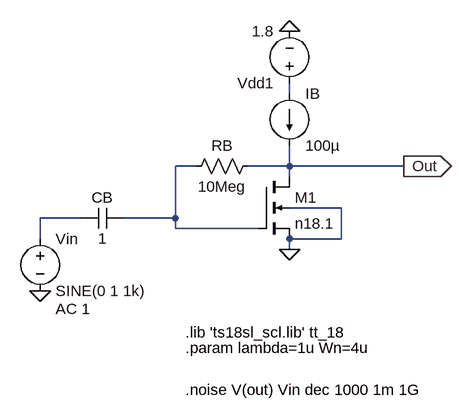
[diagram p0: schematic Q3.asc]
Q3.asc, the LTspice schematic file:
Version 4.1
SHEET 1 880 680
WIRE 192 -16 192 -32
WIRE 48 96 16 96
WIRE 192 96 192 64
WIRE 192 96 128 96
WIRE 368 96 192 96
WIRE 192 112 192 96
WIRE 272 160 192 160
WIRE -128 176 -192 176
WIRE 16 176 16 96
WIRE 16 176 -64 176
WIRE 16 192 16 176
WIRE 144 192 16 192
WIRE -192 208 -192 176
WIRE 272 208 272 160
WIRE 272 208 192 208
WIRE 192 224 192 208
FLAG 192 -112 0
FLAG 192 224 0
FLAG -192 288 0
FLAG 368 96 Out
IOPIN 368 96 Out
SYMBOL voltage 192 -16 R180
WINDOW 123 0 0 Left 0
WINDOW 39 0 0 Left 0
SYMATTR InstName Vdd1
SYMATTR Value 1.8
SYMBOL nmos4 144 112 R0
SYMATTR InstName M1
SYMATTR Value n18.1
SYMATTR Value2 l={2*lambda} w={Wn} ad={5*lambda*Wn} as={5*lambda*Wn} pd={2*Wn + 10*lambda} ps={2*Wn + 10*lambda}
SYMBOL voltage -192 192 R0
WINDOW 123 24 124 Left 2
WINDOW 39 0 0 Left 0
SYMATTR Value2 AC 1
SYMATTR InstName Vin
SYMATTR Value SINE(0 1 1k)
SYMBOL current 192 -16 R0
WINDOW 123 0 0 Left 0
WINDOW 39 0 0 Left 0
SYMATTR InstName IB
SYMATTR Value 100µ
SYMBOL res 144 80 R90
WINDOW 0 0 56 VBottom 2
WINDOW 3 32 56 VTop 2
SYMATTR InstName RB
SYMATTR Value 10Meg
SYMBOL cap -64 160 R90
WINDOW 0 0 32 VBottom 2
WINDOW 3 32 32 VTop 2
SYMATTR InstName CB
SYMATTR Value 1
TEXT 32 376 Left 2 !.param lambda=1u Wn=4u
TEXT 32 352 Left 2 !.lib 'ts18sl_scl.lib' tt_18
TEXT 32 440 Left 2 !.noise V(out) Vin dec 1000 1m 1G

The netlist it stands for:
* Q3.asc
Vdd1 N001 0 1.8
M1 Out N002 0 0 n18.1 l={2*lambda} w={Wn} ad={5*lambda*Wn} as={5*lambda*Wn} pd={2*Wn + 10*lambda} ps={2*Wn + 10*lambda}
Vin N003 0 SINE(0 1 1k) AC 1
IB N001 Out 100µ
RB Out N002 10Meg
CB N002 N003 1
.model NMOS NMOS
.model PMOS PMOS
.lib standard.mos
.param lambda=1u Wn=4u
.lib 'ts18sl_scl.lib' tt_18
.noise V(out) Vin dec 1000 1m 1G
.backanno
.end